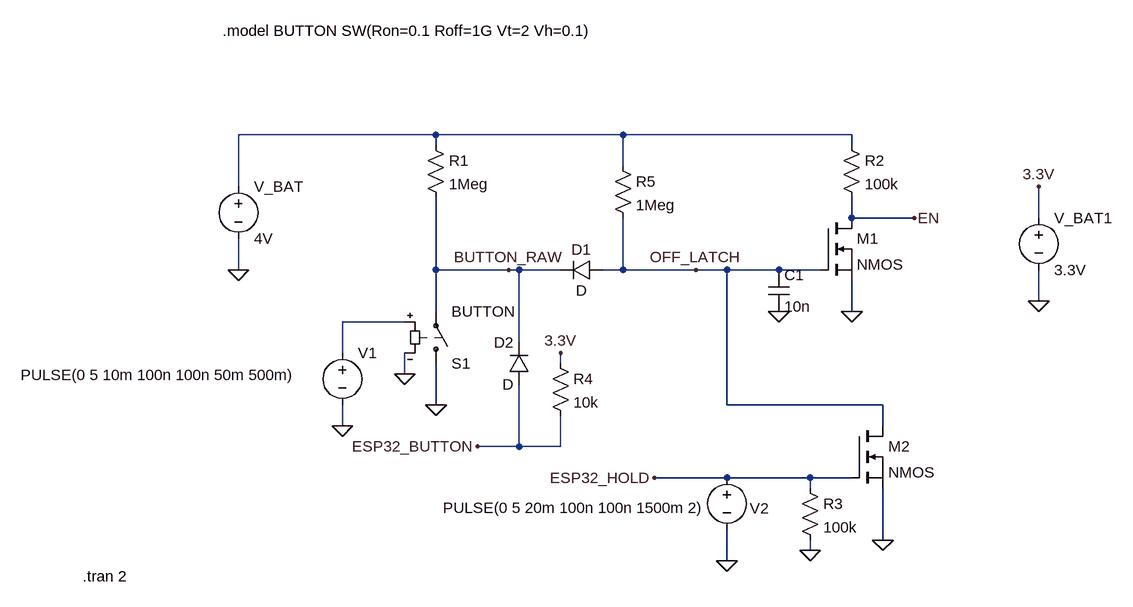
[diagram p0: schematic Power Button.asc]
Power Button.asc, the LTspice schematic file:
Version 4.1
SHEET 1 1156 824
WIRE 112 112 -192 112
WIRE 400 112 112 112
WIRE 752 112 400 112
WIRE 112 128 112 112
WIRE 752 128 752 112
WIRE 400 160 400 112
WIRE -192 192 -192 112
WIRE 752 240 752 208
WIRE 848 240 752 240
WIRE 1040 240 1040 192
WIRE -192 320 -192 272
WIRE 112 320 112 208
WIRE 224 320 112 320
WIRE 240 320 224 320
WIRE 304 320 240 320
WIRE 400 320 400 240
WIRE 400 320 368 320
WIRE 512 320 400 320
WIRE 560 320 512 320
WIRE 640 320 560 320
WIRE 704 320 640 320
WIRE 1040 368 1040 320
WIRE 112 384 112 320
WIRE 752 384 752 336
WIRE 64 400 -32 400
WIRE 240 432 240 320
WIRE -32 448 -32 400
WIRE 304 464 304 448
WIRE 64 480 64 448
WIRE 112 528 112 464
WIRE 560 528 560 320
WIRE 800 528 560 528
WIRE -32 560 -32 528
WIRE 800 560 800 528
WIRE 240 592 240 496
WIRE 240 592 176 592
WIRE 304 592 304 544
WIRE 304 592 240 592
WIRE 560 640 448 640
WIRE 688 640 560 640
WIRE 752 640 688 640
WIRE 688 656 688 640
WIRE 800 736 800 656
WIRE 688 752 688 736
WIRE 560 768 560 720
FLAG -192 320 0
FLAG -32 560 0
FLAG 64 480 0
FLAG 112 528 0
FLAG 512 320 OFF_LATCH
FLAG 752 384 0
FLAG 848 240 EN
FLAG 448 640 ESP32_HOLD
FLAG 688 752 0
FLAG 800 736 0
FLAG 224 320 BUTTON_RAW
FLAG 176 592 ESP32_BUTTON
FLAG 560 768 0
FLAG 304 448 3.3V
FLAG 1040 192 3.3V
FLAG 1040 368 0
FLAG 640 384 0
SYMBOL voltage -192 176 R0
WINDOW 123 0 0 Left 0
WINDOW 39 0 0 Left 0
SYMATTR InstName V_BAT
SYMATTR Value 4V
SYMBOL res 96 112 R0
SYMATTR InstName R1
SYMATTR Value 1Meg
SYMBOL sw 112 480 M180
SYMATTR InstName S1
SYMATTR Value BUTTON
SYMBOL voltage -32 432 R0
WINDOW 3 -495 50 Left 2
WINDOW 123 0 0 Left 0
WINDOW 39 0 0 Left 0
SYMATTR Value PULSE(0 5 10m 100n 100n 50m 500m)
SYMATTR InstName V1
SYMBOL nmos 704 240 R0
SYMATTR InstName M1
SYMBOL res 736 112 R0
SYMATTR InstName R2
SYMATTR Value 100k
SYMBOL nmos 752 560 R0
SYMATTR InstName M2
SYMBOL res 672 640 R0
SYMATTR InstName R3
SYMATTR Value 100k
SYMBOL diode 368 304 R90
WINDOW 0 0 32 VBottom 2
WINDOW 3 32 32 VTop 2
SYMATTR InstName D1
SYMBOL diode 256 496 R180
WINDOW 0 24 64 Left 2
WINDOW 3 24 0 Left 2
SYMATTR InstName D2
SYMBOL voltage 560 624 R0
WINDOW 0 35 63 Left 2
WINDOW 3 -437 62 Left 2
WINDOW 123 0 0 Left 0
WINDOW 39 0 0 Left 0
SYMATTR InstName V2
SYMATTR Value PULSE(0 5 20m 100n 100n 1500m 2)
SYMBOL res 288 448 R0
SYMATTR InstName R4
SYMATTR Value 10k
SYMBOL voltage 1040 224 R0
WINDOW 123 0 0 Left 0
WINDOW 39 0 0 Left 0
SYMATTR InstName V_BAT1
SYMATTR Value 3.3V
SYMBOL cap 624 320 R0
SYMATTR InstName C1
SYMATTR Value 10n
SYMBOL res 384 144 R0
SYMATTR InstName R5
SYMATTR Value 1Meg
TEXT -432 792 Left 2 !.tran 2
TEXT -216 -48 Left 2 !.model BUTTON SW(Ron=0.1 Roff=1G Vt=2 Vh=0.1)

The netlist it stands for:
* Power Button.asc
V_BAT N001 0 4V
R1 N001 BUTTON_RAW 1Meg
S1 0 BUTTON_RAW N002 0 BUTTON
V1 N002 0 PULSE(0 5 10m 100n 100n 50m 500m)
M1 EN OFF_LATCH 0 0 NMOS
R2 N001 EN 100k
M2 OFF_LATCH ESP32_HOLD 0 0 NMOS
R3 ESP32_HOLD 0 100k
D1 OFF_LATCH BUTTON_RAW D
D2 ESP32_BUTTON BUTTON_RAW D
V2 ESP32_HOLD 0 PULSE(0 5 20m 100n 100n 1500m 2)
R4 3.3V ESP32_BUTTON 10k
V_BAT1 3.3V 0 3.3V
C1 OFF_LATCH 0 10n
R5 N001 OFF_LATCH 1Meg
.model D D
.lib standard.dio
.model NMOS NMOS
.model PMOS PMOS
.lib standard.mos
.tran 2
.model BUTTON SW(Ron=0.1 Roff=1G Vt=2 Vh=0.1)
.backanno
.end